# EAGLE design Grove_Pulse_Counter (EAGLE 7.4.0)
CNAME: Whatnick INC; CREVISION: 1.0; DESIGNER: Tisham Dhar
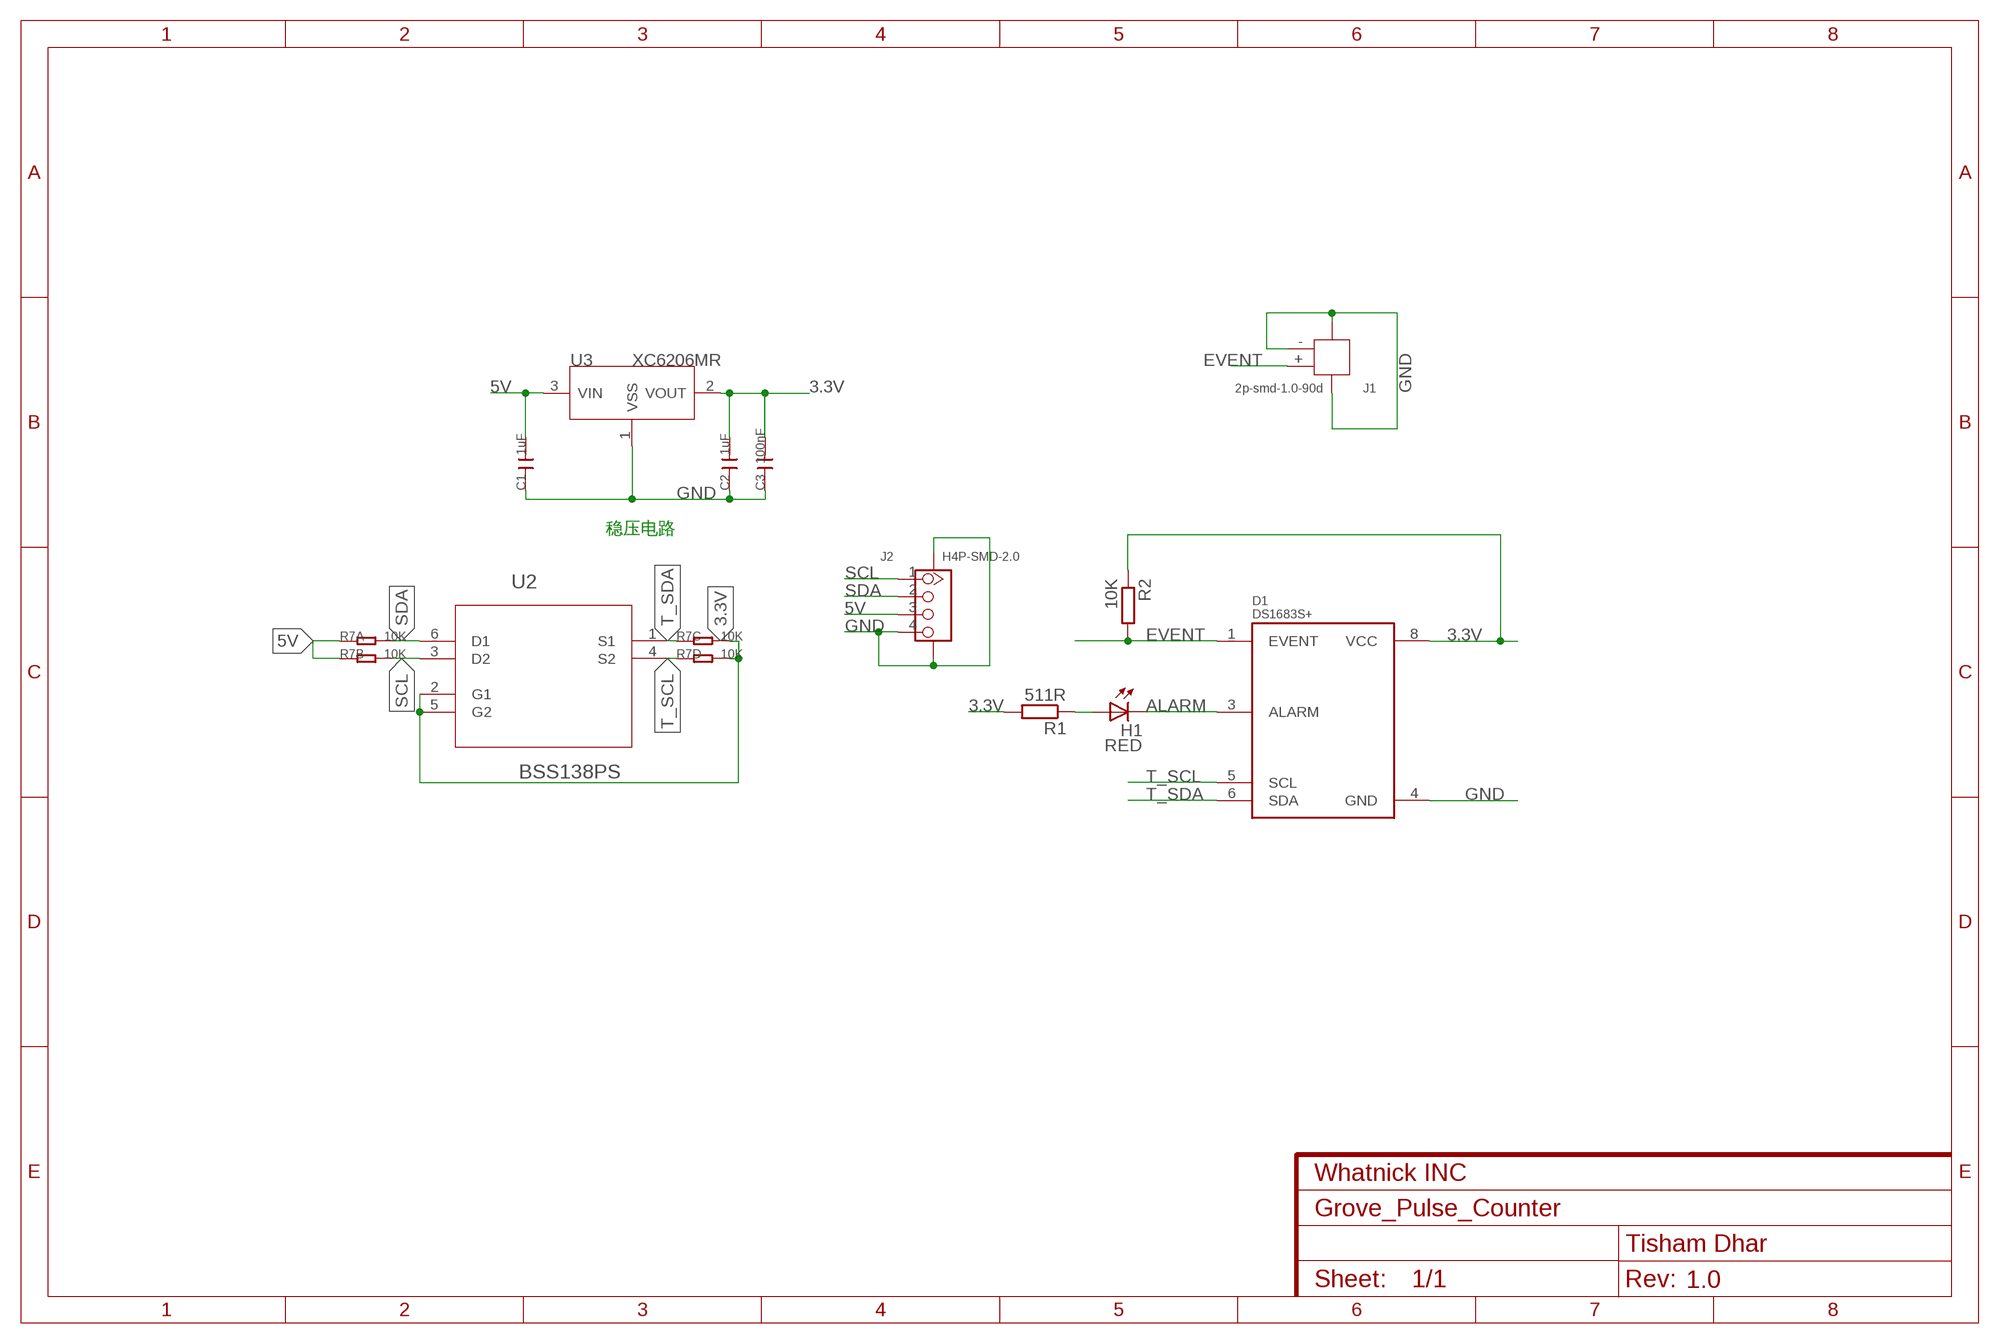
[diagram p0: schematic, sheet 1]

## Parts
C1  1uF  C-0603  [C0603]
C2  1uF  C-0603  [C0603]
C3  100nF  C-0603  [C0603]
D1  DS1683S+  [SOIC8-N_MC]
H1  RED  LEDCHIPLED_0603  [CHIPLED_0603]
J1  2p-smd-1.0-90d  SMD-JST-2P-1.0-90D  [HW2-SMD-1.0-90D]
J2  H4P-SMD-2.0  GROVE-CONNECTOR-SMD(4+2P-2.0)  [HW4-SMD-2.0]
R1  511R  R-EU_R0603  [R0603]
R2  10K  R-EU_R0603  [R0603]
R7  10K  R-4R-1206  [1206-8-3.3X2.4]
U2  BSS138PS  [SOT65P210X110-6N]
U3  XC6206MR  [SOT23]

## Nets
3.3V [3V3]: C2.2 C3.2 D1.8(VCC) R1.2 R2.1 R7.5 R7.6 U2.2(G1) U2.5(G2) U3.2(VOUT)
5V [3V3]: C1.2 J2.3 R7.1 R7.2 U3.3(VIN)
ALARM: D1.3(ALARM) H1.C
EVENT: D1.1(EVENT) J1.+ R2.2
GND [3V3]: C1.1 C2.1 C3.1 D1.4(GND) J1.3 J1.4 J1.- J2.4 J2.SS1 J2.SS2 U3.1(VSS)
N$1: H1.A R1.1
SCL: J2.1 R7.7 U2.3(D2)
SDA: J2.2 R7.8 U2.6(D1)
T_SCL: D1.5(SCL) R7.4 U2.4(S2)
T_SDA: D1.6(SDA) R7.3 U2.1(S1)

## Notes on the sheet
- 稳压电路

## Library data of the parts
C1-C3 = Discrete:C*: Ceramic Capacitors
D1 = OMAT_IC:DS1683
H1 = OMAT_IC:LED: LED OSRAM: - CHIPLED LG R971, LG N971, LY N971, LG Q971, LY Q971, LO R971, LY R971 LH N974, LH R974 LS Q976, LO Q976, LY Q976 LO Q996 - Hyper CHIPLED LW Q18S LB Q993, LB Q99A, LB R99A - SideLED LS A670, LO A670, LY A670, LG A670, LP A670 LB A673, LV A673, LT A673, LW A673 LH A674 LY A675 LS A676, LA A676, LO A676, LY A676, LW A676 LS A679, LY A679, LG A679 - Hyper Micro SIDELED® LS Y876, LA Y876, LO Y876, LY Y876 LT Y87S - SmartLED LW L88C, LW L88S LB L89C, LB L89S, LG L890 LS L89K, LO L89K, LY L89K LS L896, LA L896, LO L896, LY L896 - TOPLED LS T670, LO T670, LY T670, LG T670, LP T670 LSG T670, LSP T670, LSY T670, LOP T670, LYG T670 LG T671, LOG T671, LSG T671 LB T673, LV T673, LT T673, LW T673 LH T674 LS T676, LA T676, LO T676, LY T676, LB T676, LH T676, LSB T676, LW T676 LB T67C, LV T67C, LT T67C, LS T67K, LO T67K, LY T67K, LW E67C LS E67B, LA E67B, LO E67B, LY E67B, LB E67C, LV E67C, LT E67C LW T67C LS T679, LY T679, LG T679 LS T770, LO T770, LY T770, LG T770, LP T770 LB T773, LV T773, LT T773, LW T773 LH T774 LS E675, LA E675, LY E675, LS T675 LS T776, LA T776, LO T776, LY T776, LB T776 LHGB T686 LT T68C, LB T68C - Hyper Mini TOPLED® LB M676 - Mini TOPLED Santana® LG M470 LS M47K, LO M47K, LY M47K Source: http://www.osram.convergy.de LUXEON: - LUMILED® LXK2-PW12-R00, LXK2-PW12-S00, LXK2-PW14-U00, LXK2-PW14-V00 LXK2-PM12-R00, LXK2-PM12-S00, LXK2-PM14-U00 LXK2-PE12-Q00, LXK2-PE12-R00, LXK2-PE12-S00, LXK2-PE14-T00, LXK2-PE14-U00 LXK2-PB12-K00, LXK2-PB12-L00, LXK2-PB12-M00, LXK2-PB14-N00, LXK2-PB14-P00, LXK2-PB14-Q00 LXK2-PR12-L00, LXK2-PR12-M00, LXK2-PR14-Q00, LXK2-PR14-R00 LXK2-PD12-Q00, LXK2-PD12-R00, LXK2-PD12-S00 LXK2-PH12-R00, LXK2-PH12-S00 LXK2-PL12-P00, LXK2-PL12-Q00, LXK2-PL12-R00 Source: www.luxeon.com KINGBRIGHT: KA-3528ASYC Source: www.kingbright.com
J1 = Seeed-Connector -2016:SMD-JST-2P-1.0-90D: 320110054
J2 = Seeed-Connector -2016:GROVE-CONNECTOR-SMD(4+2P-2.0): 320110030
R1 R2 = rcl:R-EU_: RESISTOR, European symbol
R7 = Discrete:R-4R*: Resistor Array
U2 = NXP_By_element14_Batch_1:BSS138PS: Dual N-channel Trench MOSFET; MPN: BSS138PS; OC_FARNELL: 1972664; OC_NEWARK: 58T9002; PACKAGE: SOT-363-6; SUPPLIER: NXP
U3 = IC:XC6206: LOW ESR Cap.Compatible Positive Voltage Regulators

## Net classes
0 default: width 0.152 mm, drill 0.305 mm, clearance 0.152 mm
2 3V3: width 0.305 mm, drill 0.305 mm, clearance 0.152 mm to class 0, clearance 0.203 mm to class 1

## Board
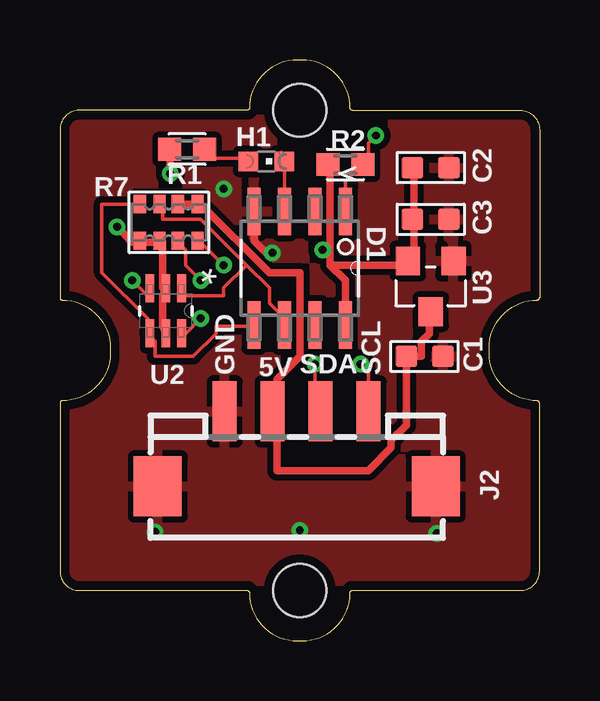
[diagram p1: board, top side]
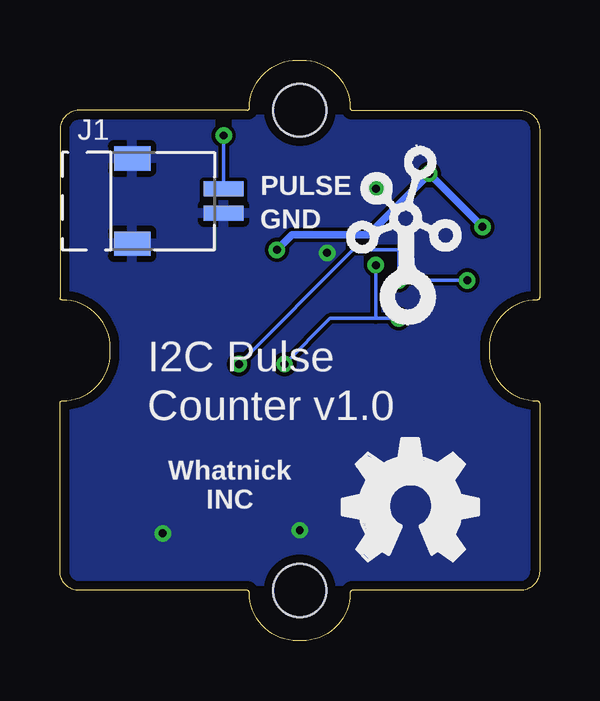
[diagram p2: board, bottom side, seen from below]

Size 20 x 24.2 mm. Coordinates in mm from the lower left corner, seen from the top.
Copper layers (1*16): Top 0.0356mm / dielectric 1.5011mm / Bottom 0.0356mm
Design rules "OSHPark_2layer": minimum track width 6mil, minimum drill 13mil, track to track 6mil, track to pad 6mil, pad to pad 6mil, via to via 6mil, smd to smd 6mil, copper to edge 15mil, drill to drill 6mil, minimum pad ring 7mil, minimum via ring 7mil, stop-mask expansion 3mil, vias tented up to drill 20mil, thermal gap 10mil

### Footprints (pad centres in the part's own frame; a part is rotated, then mirrored left to right if it is on the bottom)
C0603 = smd 0.889 x 0.889: 1 -0.762,0; 2 0.762,0
SOIC8-N_MC = smd 1.981 x 0.559: 1 -2.362,1.905; 2 -2.362,0.635; 3 -2.362,-0.635; 4 -2.362,-1.905; 5 2.362,-1.905; 6 2.362,-0.635; 7 2.362,0.635; 8 2.362,1.905
CHIPLED_0603 = smd 0.8 x 0.8: A 0,-0.75; C 0,0.75
HW2-SMD-1.0-90D = smd 1.524 x 1.016: 3 -3.429,1.778; 4 -3.429,-1.778 | smd 1.651 x 0.635: + 0.381,0.508; - 0.381,-0.508
HW4-SMD-2.0 = smd 1 x 2.5: 1 -3,0; 2 -1,0; 3 1,0; 4 3,0 | smd 2 x 2.5: SS1 -5.8,3.123; SS2 5.8,3.123
R0603 = smd 0.95 x 0.95: 1 -0.725,0; 2 0.725,0
1206-8-3.3X2.4 = smd 0.508 x 0.762: 1 -1.206,-0.762; 2 -0.381,-0.762; 3 0.381,-0.762; 4 1.206,-0.762; 5 1.206,0.762; 6 0.381,0.762; 7 -0.381,0.762; 8 -1.206,0.762
SOT65P210X110-6N = smd 1.168 x 0.356: 1 -0.94,0.66; 2 -0.94,0; 3 -0.94,-0.66; 4 0.94,-0.66; 5 0.94,0; 6 0.94,0.66
SOT23 = smd 1.016 x 1.2: 1 -0.95,-1.06; 2 0.95,-1.06; 3 0,1.06
1U-DIM-W/-DRILL = hole 2.2: 0,-10; 0,10

### Placement (x,y rotation side)
C1  15.21,11.85 180 top
C2  15.46,19.72 180 top
C3  15.46,17.56 180 top
D1  10,15.53 270 top
H1  8.6,19.97 270 top
J1  13.56,18.32 0 bottom
J2  9.87,9.56 180 top
R1  5.3,20.48 180 top
R2  11.9,19.85 0 top
R7  4.54,17.43 180 top
U2  4.41,13.75 270 top
U3  15.46,14.77 180 top
U$2  [1U-DIM-W/-DRILL]  10,12.1 0 top
U$3  [TWIGLOGO]  5.55,14.13 0 bottom
U$4  [OSHW_FILLX200_NOTEXT]  8.22,3.34 0 bottom

### Tracks (layer width: path | path; a pad name or v marks a point on that pad's centre or on a via)
3.3V  (via drill 0.33)
  Top 0.305: U2.5 4.29,13.12 4.29,14.39 U2.2 4.29,14.7 4.29,16.61 R7.6 3.97,16.61 3.33,16.61 | v4.6,19.47 4.6,20.42 R1.2 | v2.38,17.24 3.02,16.61 3.33,16.61 | 3.33,16.61 R7.5 | 14.76,17.56 14.76,15.97 U3.2 14.45,15.66 11.27,15.66 | 14.76,17.56 14.76,19.47 C2.2 | 14.76,17.56 C3.2 | 11.27,15.66 11.27,16.29 | 11.27,16.29 11.27,19.78 R2.1 | 11.27,15.66 11.9,15.02 D1.8 | 11.27,16.29 v10.95,16.29
  Bottom 0.305: v2.38,17.24 v4.6,19.47 7.14,16.93 10.32,16.93 v10.95,16.29
5V
  Top 0.305: U3.3 15.4,13.43 15.4,12.8 15.08,12.48 15.08,11.85 C1.2 14.45,8.99 13.81,8.35 13.81,8.04 12.86,7.08 9.05,7.08 9.05,9.31 J2.3 9.05,9.62 9.05,10.89 10,11.85 10,15.34 8.73,15.34 5.87,18.2 R7.1 R7.2
ALARM
  Top 0.152: D1.3 9.37,19.78 H1.C
EVENT  (via drill 0.33)
  Top 0.152: D1.1 11.9,19.15 12.54,19.78 R2.2 12.86,20.1 12.86,20.74 v13.18,21.05
  Bottom 0.152: v13.18,21.05 J1.+
GND  (via drill 0.33)
  Top 0.305: D1.4 8.1,16.67 8.6,16.16 v8.86,16.16
  other vias: 3.97,4.54 6.83,18.83 15.72,4.48 10,4.61
  pour Bottom: -0.79,25.18 20.8,25.18 20.8,-0.22 -0.79,-0.22
  pour Top (isolate 0.254): -0.79,25.18 20.8,25.18 20.8,-0.22 -0.79,-0.22
N$1
  Top 0.152: H1.A 7.78,20.1 6.19,20.1 6.19,20.42 R1.1
SCL  (via drill 0.33)
  Top 0.152: v5.87,15.02 5.24,15.66 5.24,16.29 4.92,16.61 R7.7 | v3.02,15.02 3.65,14.39 U2.3 | v12.54,11.53 12.86,11.21 12.86,9.62 J2.1
  Bottom 0.152: v3.02,15.02 v5.87,15.02 5.87,16.29 7.78,16.29 v12.54,11.53
SDA  (via drill 0.33)
  Top 0.152: v6.83,15.66 5.87,16.61 R7.8 | v5.87,13.43 5.24,12.8 U2.6 | v10.63,11.53 10.63,9.62 J2.2
  Bottom 0.152: 6.83,13.43 v6.83,15.66 | v5.87,13.43 6.83,13.43 | v10.63,11.53 8.73,13.43 6.83,13.43
T_SCL
  Top 0.152: R7.4 1.75,18.2 1.75,15.34 3.65,13.43 3.65,13.12 U2.4 3.65,12.8 3.97,12.48 3.97,11.85 5.55,11.85 6.51,12.8 6.51,13.12 8.1,13.12 D1.5
T_SDA
  Top 0.152: 7.78,15.66 8.73,14.7 8.73,14.07 9.37,13.43 D1.6 | 7.78,15.66 5.87,17.56 4.29,17.56 4.29,18.2 R7.3 | 7.78,15.66 6.83,14.7 6.83,14.39 5.24,14.39 U2.1

### Text on the board
tPlace: GND | 5V | SDA | SCL
bPlace: PULSE | GND | I2C Pulse | Counter v1.0 | Whatnick / INC